# EAGLE design wf121_breakout_v10 (EAGLE 6.5.0)
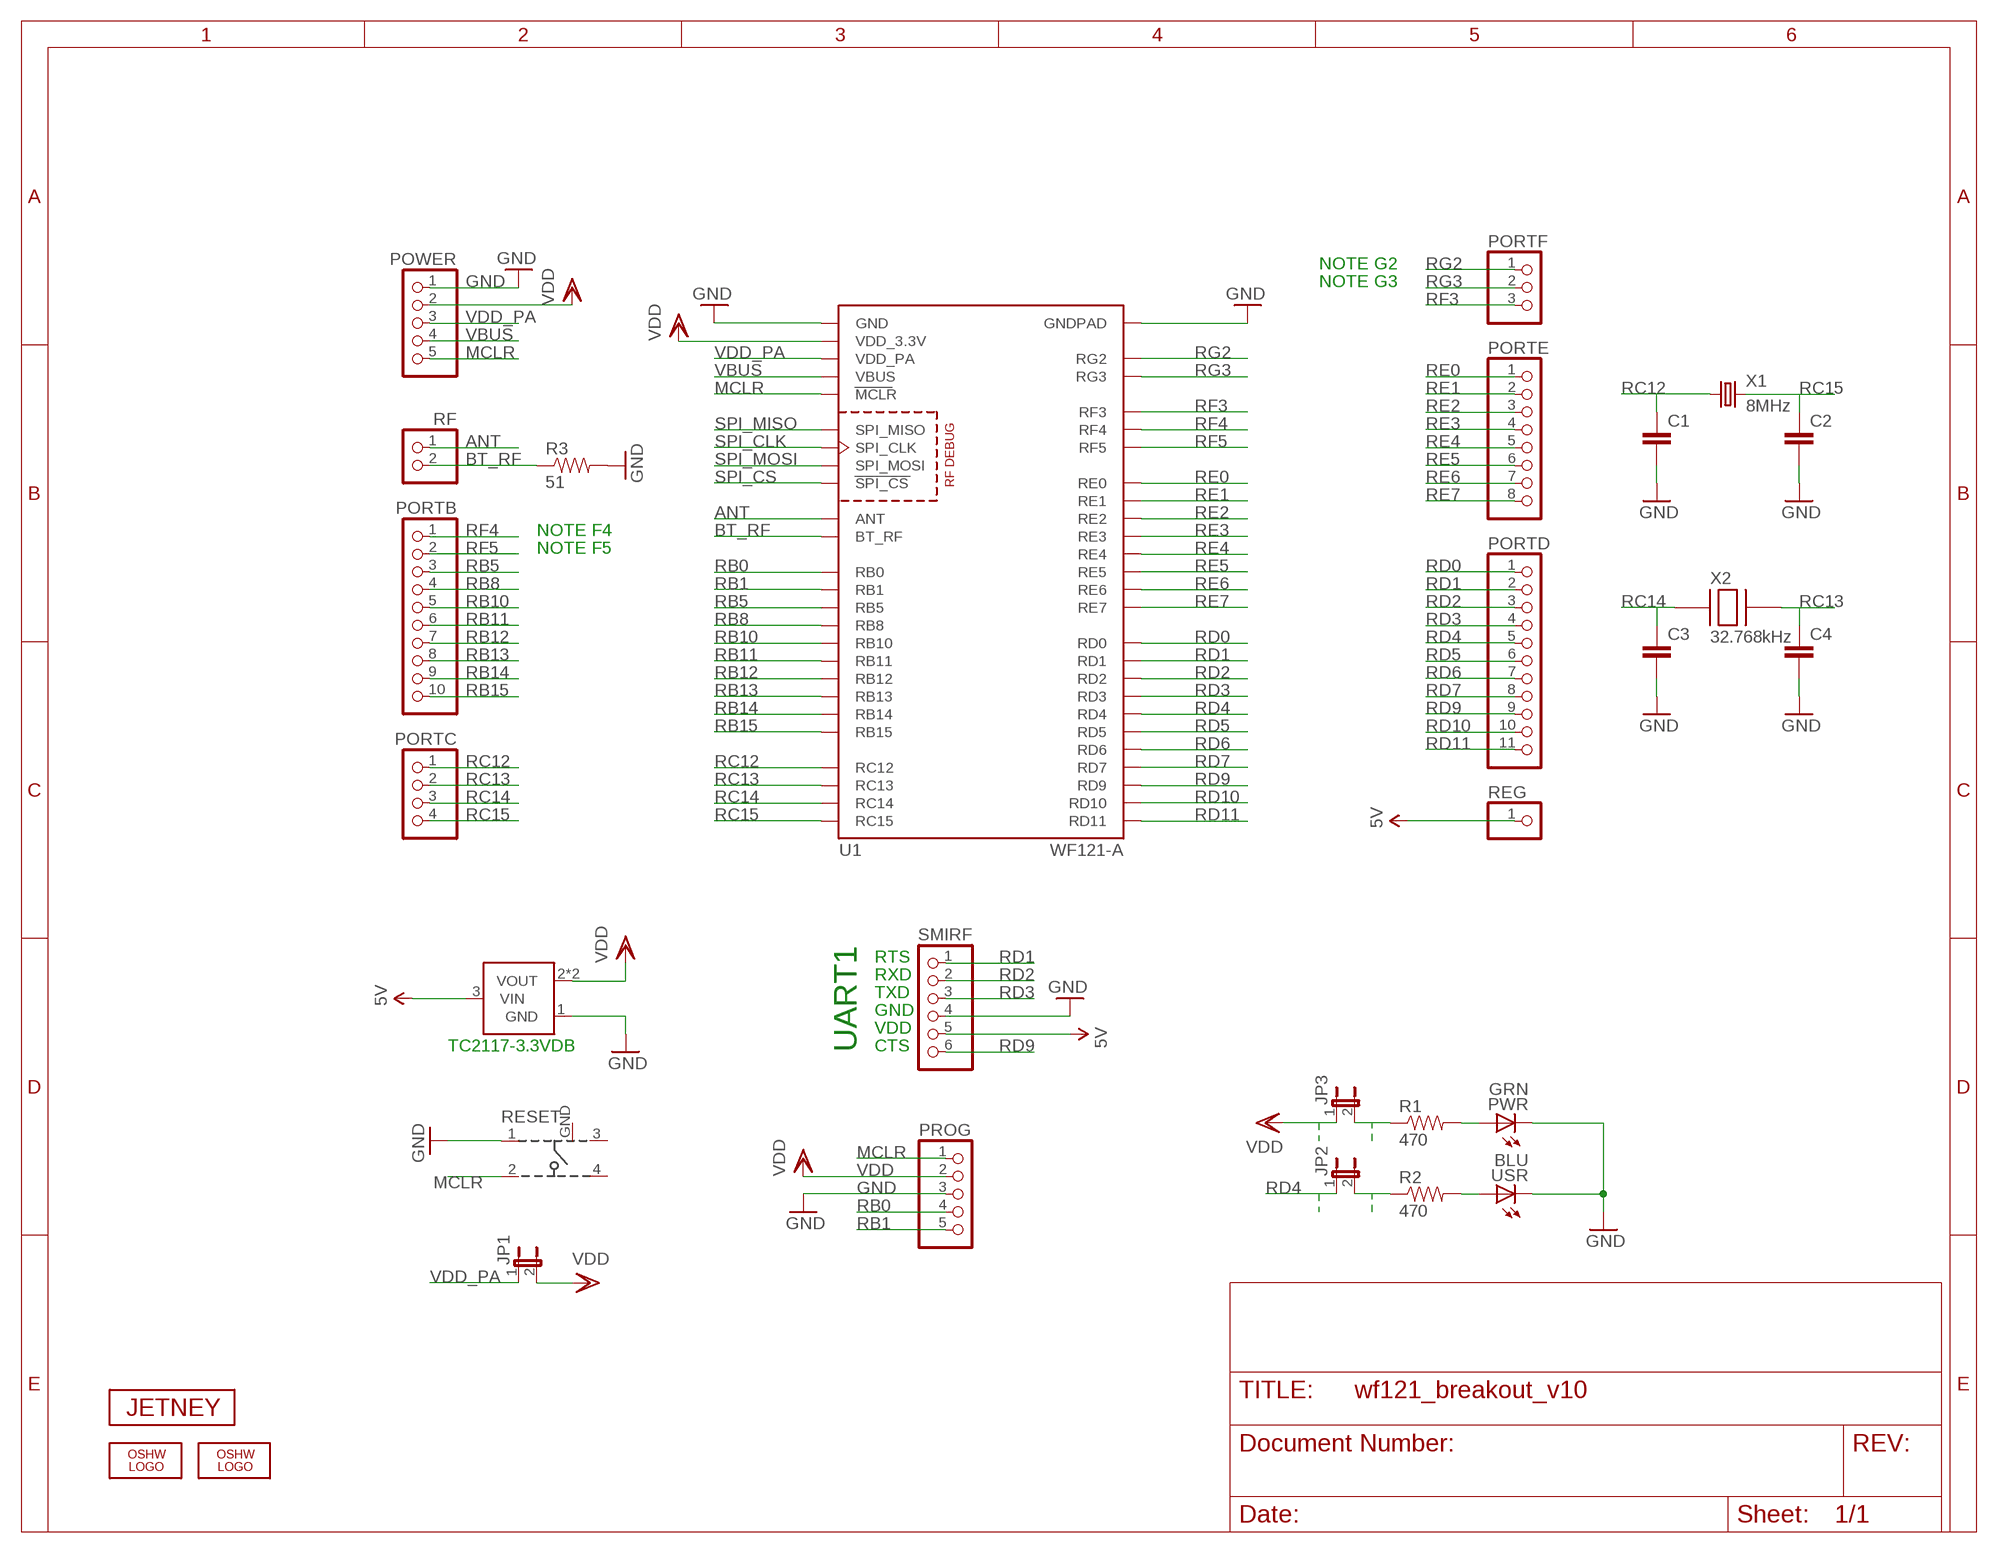
[diagram p0: schematic, sheet 1]

## Parts
C1  CAP0603-CAP  [0603-CAP]
C2  CAP0603-CAP  [0603-CAP]
C3  CAP0603-CAP  [0603-CAP]
C4  CAP0603-CAP  [0603-CAP]
JP1  JUMPER-2PTH  [1X02]
JP2  JUMPER-2SMD-NC  [SJ_2S]
JP3  JUMPER-2SMD-NC  [SJ_2S]
LOGO1  OSHW_LOGO_FILLX0100-NT  [OSHW_FILLX100_NOTEXT]
LOGO2  OSHW_LOGO_FILLX0100-NT  [OSHW_FILLX100_NOTEXT]
PORTB  PINHD-1X10  [1X10]
PORTC  PINHD-1X4  [1X04]
PORTD  PINHD-1X11  [1X11]
PORTE  PINHD-1X8  [1X08]
PORTF  PINHD-1X3  [1X03]
POWER  PINHD-1X5  [1X05]
PROG  PINHD-1X5  [1X05]
PWR  GRN  LEDCHIPLED_0805  [CHIPLED_0805]
R1  470  RESISTOR0603-RES  [0603-RES]
R2  470  RESISTOR0603-RES  [0603-RES]
R3  51  RESISTOR0603-RES  [0603-RES]
REG  PINHD-1X1  [1X01]
RESET  101-IG  [101-IG]
RF  PINHD-1X2  [1X02]
SMIRF  PINHD-1X6  [1X06]
U1  WF121-A  [WF121-A]
U2  VREGAP1117  [SOT223]
U$4  JETNEY-LOGO-12  [JETNEY-LOGO-12]
USR  BLU  LEDCHIPLED_0805  [CHIPLED_0805]
X1  8MHz  CRYSTALTXC-7A  [CRYSTAL-TXC-7A]
X2  32.768kHz  ABS07-120  [ABS07]

## Nets
5V [power]: REG.1 SMIRF.5 U2.3(VIN)
ANT: RF.1 U1.ANT
BT_RF: R3.1 RF.2 U1.BT_RF
GND [power]: C1.2 C2.2 C3.2 C4.2 POWER.1 PROG.3 PWR.C R3.2 RESET.1 SMIRF.4 U1.GND U1.GND@2(GND) U1.GND@3(GND) U1.GND@4(GND) U1.GND@5(GND) U1.GND@6(GND) U1.GNDPAD U2.1(GND) USR.C
MCLR: POWER.5 PROG.1 RESET.2 U1.MCLR
N$1: PWR.A R1.2
N$2: JP2.2 R2.1
N$3: R2.2 USR.A
N$4 [power]: JP3.2 R1.1
RB0: PROG.4 U1.RB0
RB1: PROG.5 U1.RB1
RB5: PORTB.3 U1.RB5
RB8: PORTB.4 U1.RB8
RB10: PORTB.5 U1.RB10
RB11: PORTB.6 U1.RB11
RB12: PORTB.7 U1.RB12
RB13: PORTB.8 U1.RB13
RB14: PORTB.9 U1.RB14
RB15: PORTB.10 U1.RB15
RC12: C1.1 PORTC.1 U1.RC12 X1.P$1
RC13: C4.1 PORTC.2 U1.RC13 X2.X2
RC14: C3.1 PORTC.3 U1.RC14 X2.X1
RC15: C2.1 PORTC.4 U1.RC15 X1.P$2
RD0: PORTD.1 U1.RD0
RD1: PORTD.2 SMIRF.1 U1.RD1
RD2: PORTD.3 SMIRF.2 U1.RD2
RD3: PORTD.4 SMIRF.3 U1.RD3
RD4: JP2.1 PORTD.5 U1.RD4
RD5: PORTD.6 U1.RD5
RD6: PORTD.7 U1.RD6
RD7: PORTD.8 U1.RD7
RD9: PORTD.9 SMIRF.6 U1.RD9
RD10: PORTD.10 U1.RD10
RD11: PORTD.11 U1.RD11
RE0: PORTE.1 U1.RE0
RE1: PORTE.2 U1.RE1
RE2: PORTE.3 U1.RE2
RE3: PORTE.4 U1.RE3
RE4: PORTE.5 U1.RE4
RE5: PORTE.6 U1.RE5
RE6: PORTE.7 U1.RE6
RE7: PORTE.8 U1.RE7
RF3: PORTF.3 U1.RF3
RF4: PORTB.1 U1.RF4
RF5: PORTB.2 U1.RF5
RG2: PORTF.1 U1.RG2
RG3: PORTF.2 U1.RG3
SPI_CLK: U1.SPI_CLK
SPI_CS: U1.SPI_CS
SPI_MISO: U1.SPI_MISO
SPI_MOSI: U1.SPI_MOSI
VBUS: POWER.4 U1.VBUS
VDD [power]: JP1.2 JP3.1 POWER.2 PROG.2 U1.VDD_3.3V U2.2(VOUT) U2.4(VOUT)
VDD_PA [power]: JP1.1 POWER.3 U1.VDD_PA
Unconnected: RESET.3 RESET.4

## Notes on the sheet
- NOTE G2
- NOTE G3
- NOTE F4
- NOTE F5
- RTS
- RXD
- TXD
- GND
- VDD
- TC2117-3.3VDB | UART1 | CTS

## Power pins joined to a net without a drawn wire
GND: RESET.GND

## Library data of the parts
C1-C4 = SparkFun-Passives:CAP: Capacitor Standard 0603 ceramic capacitor, and 0.1" leaded capacitor.
JP1-JP3 = SparkFun:JUMPER-2: Jumper Basic 0.1" spaced jumper. Use with breakaway headers.
LOGO1 LOGO2 = oshw-logo:OSHW_LOGO_FILL
PORTB = sf-pinhead:PINHD-1X10: PIN HEADER
PORTC = sf-pinhead:PINHD-1X4: PIN HEADER
PORTD = sf-pinhead:PINHD-1X11: PIN HEADER
PORTE = sf-pinhead:PINHD-1X8: PIN HEADER
PORTF = sf-pinhead:PINHD-1X3: PIN HEADER
POWER PROG = sf-pinhead:PINHD-1X5: PIN HEADER
PWR USR = adafruit:LED: LED OSRAM: - CHIPLED LG R971, LG N971, LY N971, LG Q971, LY Q971, LO R971, LY R971 LH N974, LH R974 LS Q976, LO Q976, LY Q976 LO Q996 - Hyper CHIPLED LW Q18S LB Q993, LB Q99A, LB R99A - SideLED LS A670, LO A670, LY A670, LG A670, LP A670 LB A673, LV A673, LT A673, LW A673 LH A674 LY A675 LS A676, LA A676, LO A676, LY A676, LW A676 LS A679, LY A679, LG A679 - Hyper Micro SIDELED® LS Y876, LA Y876, LO Y876, LY Y876 LT Y87S - SmartLED LW L88C, LW L88S LB L89C, LB L89S, LG L890 LS L89K, LO L89K, LY L89K LS L896, LA L896, LO L896, LY L896 - TOPLED LS T670, LO T670, LY T670, LG T670, LP T670 LSG T670, LSP T670, LSY T670, LOP T670, LYG T670 LG T671, LOG T671, LSG T671 LB T673, LV T673, LT T673, LW T673 LH T674 LS T676, LA T676, LO T676, LY T676, LB T676, LH T676, LSB T676, LW T676 LB T67C, LV T67C, LT T67C, LS T67K, LO T67K, LY T67K, LW E67C LS E67B, LA E67B, LO E67B, LY E67B, LB E67C, LV E67C, LT E67C LW T67C LS T679, LY T679, LG T679 LS T770, LO T770, LY T770, LG T770, LP T770 LB T773, LV T773, LT T773, LW T773 LH T774 LS E675, LA E675, LY E675, LS T675 LS T776, LA T776, LO T776, LY T776, LB T776 LHGB T686 LT T68C, LB T68C - Hyper Mini TOPLED® LB M676 - Mini TOPLED Santana® LG M470 LS M47K, LO M47K, LY M47K Source: http://www.osram.convergy.de/
R1-R3 = SparkFun:RESISTOR: Resistor Basic schematic elements and footprints for 0603, 1206, and PTH resistors.
REG = sf-pinhead:PINHD-1X1: PIN HEADER
RESET = sf-keyglove:101-IG
RF = sf-pinhead:PINHD-1X2: PIN HEADER
SMIRF = sf-pinhead:PINHD-1X6: PIN HEADER
U1 = sf-bluegiga:WF121: Bluegiga WF121 802.11b/g/n full-stack wi-fi module. WF121-A variant has an on-module ceramic chip antenna, WF121-E variant has a U.Fl connector. WF121-A variant includes keepout/restrict area. Antenna edge of the module should be flush up against the edge of the PCB. See datasheet for variant layout details. Bluegiga's WF121 is a stand-alone Wi-Fi module providing fully integrated 2.4GHz 802.11 b/g/n radio, TCP/IP stack and a 32-bit micro controller (MCU) platform for embedded applications requiring simple, low-cost and low-power wireless IP connectivity. It also provides flexible peripheral interfaces such as SPI, I2C, ADC, GPIO, Bluetooth co-existence, and timers to connect various peripheral interfaces directly to the WF121 Wi-Fi module. The WF121 Wi-Fi module also allows end-user applications to be embedded onto the on-board 32-bit MCU, using a simple Bluegiga BGScript™ scripting language and free-of-charge development tools. This eliminates need for and additional MCU and enables end users to develop smaller and lower cost Wi-Fi devices. The WF121 can also be used in modem-like mode in applications where the external MCU is needed. The 802.11 access point and HTTP server functionality is also included for easy configurations and direct connections with phones, tablets, and PCs. With an integrated 802.11 radio, antenna, single power supply, and CE, FCC, and IC regulatory certifications, the WF121 provides low-risk and fast time-to-market for applications requiring Wi-Fi connectivity. http://www.bluegiga.com/en-US/products/wifi-modules/wf121-wifi-module https://github.com/jrowberg/sf-oshw Last updated 2014-01-04 by Jeff Rowberg <jeff@rowberg.net>; ANTENNA: On-module ceramic chip antenna
U2 = nonolith:VREG
U$4 = sf-keyglove:JETNEY-LOGO
X1 = SparkFun-FreqCtrl:CRYSTAL: Various standard crystals. Proven footprints. Spark Fun Electronics SKU : COM-00534
X2 = sf-keyglove:ABS07-120

## Net classes
0 default: width 0.152 mm, drill 0.33 mm, clearance 0.152 mm
1 power: width 0.254 mm, drill 0.33 mm, clearance 0.152 mm

## Board
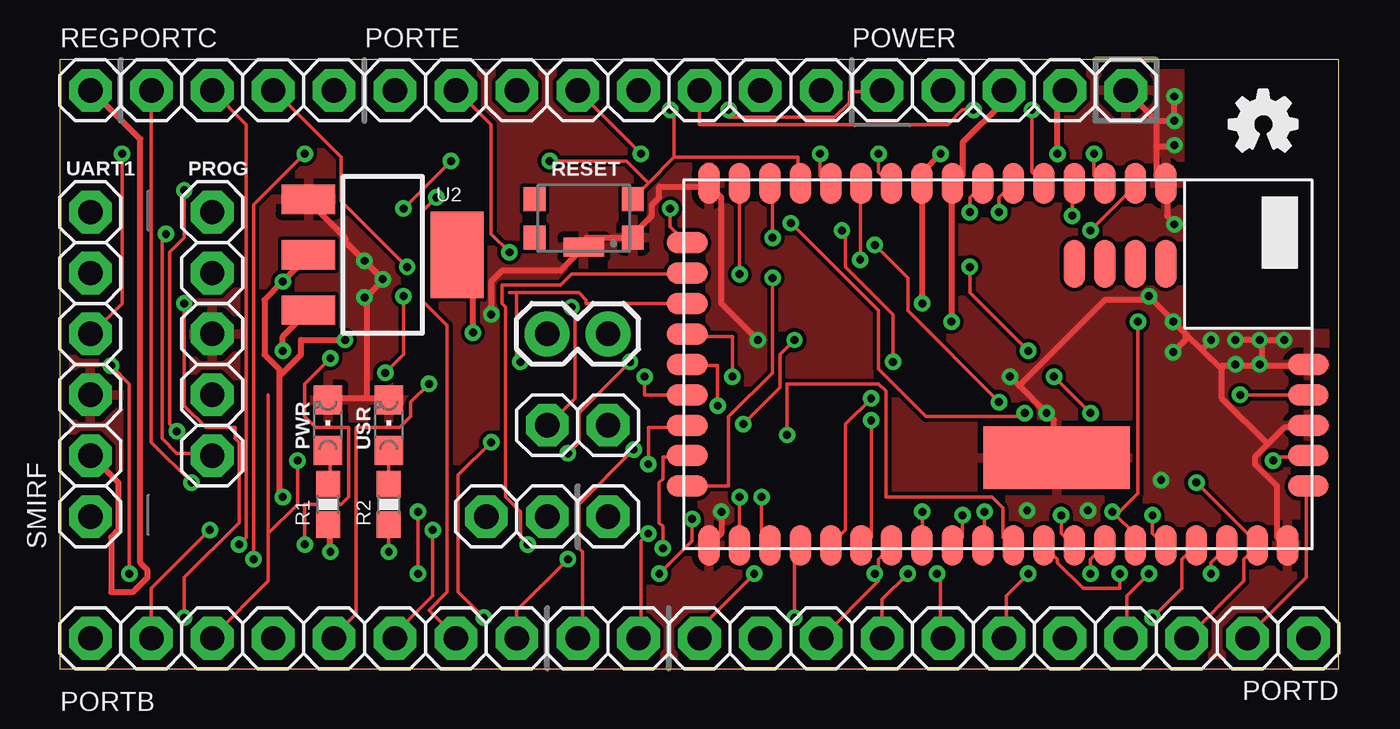
[diagram p1: board, top side]
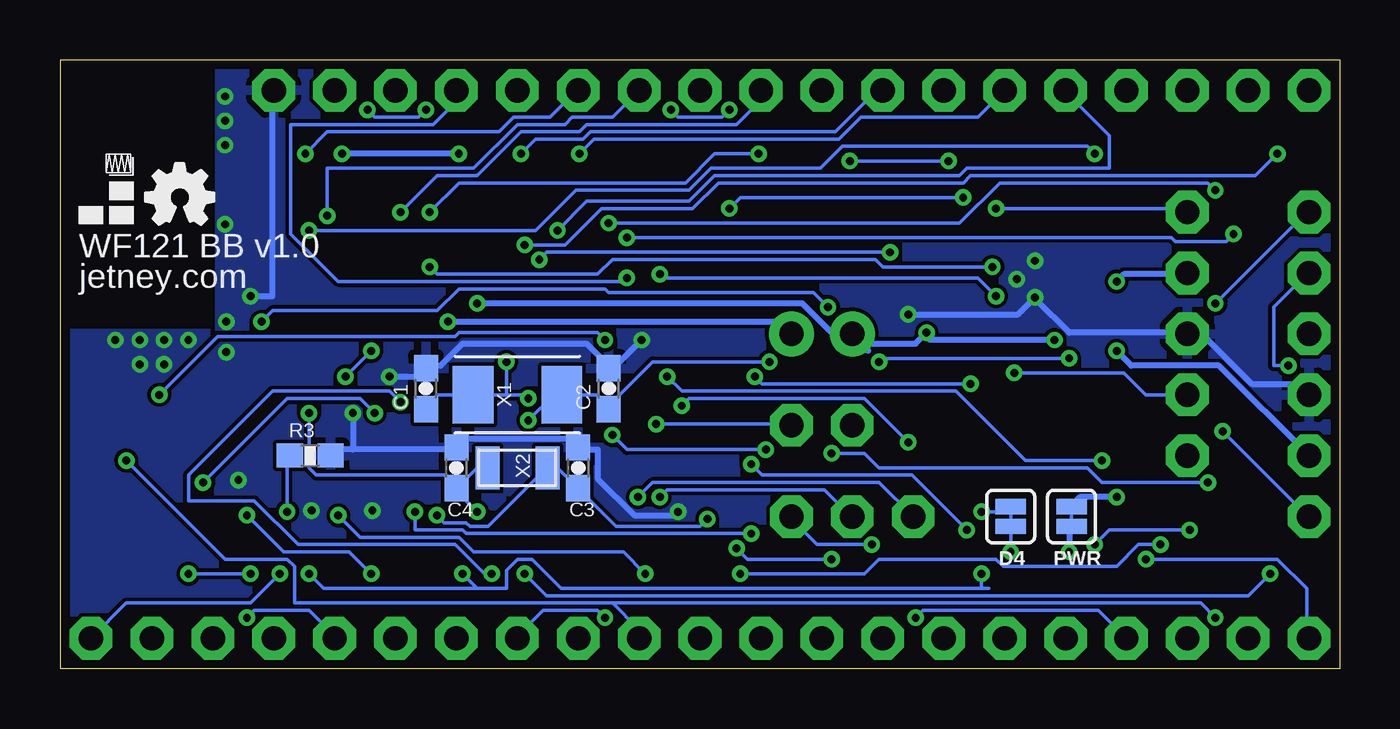
[diagram p2: board, bottom side, seen from below]

Size 53.34 x 25.4 mm. Coordinates in mm from the lower left corner, seen from the top.
Outline: 0,0 53.34,0 53.34,25.4 0,25.4 0,0
Copper layers (1*16): Top 0.0356mm / dielectric 1.5011mm / Bottom 0.0356mm
Design rules "LaenPCBOrder *": minimum track width 6mil, minimum drill 13mil, track to track 6mil, track to pad 6mil, pad to pad 6mil, via to via 6mil, smd to smd 6mil, copper to edge 15mil, drill to drill 6mil, minimum pad ring 7mil, minimum via ring 7mil, stop-mask expansion 4mil, vias tented up to drill 13mil, thermal gap 10mil
vRestrict: area 0,21.8 to 45.7,22.9; area 0,2.5 to 53.3,3.6; area 2.5,5.1 to 3.6,20.3; area 9.9,9.1 to 10.4,10.7; area 12.4,9.1 to 13,10.7; area 7.6,7.6 to 8.6,20.3; area 17,7.9 to 23.4,8.6; area 19.6,11.7 to 23.9,12.4; area 19.6,15.5 to 23.4,16.3

### Footprints (pad centres in the part's own frame; a part is rotated, then mirrored left to right if it is on the bottom)
0603-CAP = smd 1.1 x 1: 1 -0.85,0; 2 0.85,0
1X02 = drill 1.016 pad 1.88: 1 0,0; 2 2.54,0
SJ_2S = smd 0.635 x 1.27: 1 -0.412,0; 2 0.412,0
1X10 = drill 1.016 pad 1.778 octagon: 1 -11.43,0; 2 -8.89,0; 3 -6.35,0; 4 -3.81,0; 5 -1.27,0; 6 1.27,0; 7 3.81,0; 8 6.35,0; 9 8.89,0; 10 11.43,0
1X04 = drill 1.016 pad 1.778 octagon: 1 -3.81,0; 2 -1.27,0; 3 1.27,0; 4 3.81,0
1X11 = drill 1.016 pad 1.778 octagon: 1 -12.7,0; 2 -10.16,0; 3 -7.62,0; 4 -5.08,0; 5 -2.54,0; 6 0,0; 7 2.54,0; 8 5.08,0; 9 7.62,0; 10 10.16,0; 11 12.7,0
1X08 = drill 1.016 pad 1.778 octagon: 1 -8.89,0; 2 -6.35,0; 3 -3.81,0; 4 -1.27,0; 5 1.27,0; 6 3.81,0; 7 6.35,0; 8 8.89,0
1X03 = drill 1.016 pad 1.778 octagon: 1 -2.54,0; 2 0,0; 3 2.54,0
1X05 = drill 1.016 pad 1.778 octagon: 1 -5.08,0; 2 -2.54,0; 3 0,0; 4 2.54,0; 5 5.08,0
CHIPLED_0805 = smd 1.2 x 1.2: A 0,-1.05; C 0,1.05
0603-RES = smd 1.1 x 1: 1 -0.85,0; 2 0.85,0
1X01 = drill 1.016 pad 1.778 octagon: 1 0,0
101-IG = smd 0.9 x 1: 1 -2.05,0.8; 2 -2.05,-0.8; 3 2.05,0.8; 4 2.05,-0.8 | smd 1.7 x 0.8: GND 0,1.2
1X02' = drill 1.016 pad 1.778 octagon: 1 -1.27,0; 2 1.27,0
1X06 = drill 1.016 pad 1.778 octagon: 1 -6.35,0; 2 -3.81,0; 3 -1.27,0; 4 1.27,0; 5 3.81,0; 6 6.35,0
WF121-A = smd 0.9 x 1.7: ANT 1.27,12.95; GND@5 2.54,12.95; GND@6 0,12.95; RB5 3.81,-12.95; RB8 -5.08,-12.95; RB10 2.54,-12.95; RB11 1.27,-12.95; RB12 0,-12.95; RB13 -1.27,-12.95; RB14 -2.54,-12.95; RD1 3.81,12.95; RD10 5.08,12.95; RF3 -3.81,-12.95; VBUS 5.08,-12.95 | smd 1.7 x 0.9: BT_RF 7.55,5.73; GND -7.55,7; GND@2 -7.55,-12.05; GND@3 7.55,-12.05; GND@4 7.55,12.08; MCLR -7.55,-8.24; RB0 -7.55,-10.78; RB1 -7.55,-9.51; RB15 -7.55,5.73; RC12 7.55,-6.97; RC13 7.55,-3.16; RC14 7.55,-1.89; RC15 7.55,-5.7; RD0 7.55,3.19; RD2 7.55,-4.43; RD3 7.55,-8.24; RD4 7.55,4.46; RD5 7.55,7; RD6 7.55,8.27; RD7 7.55,9.54; RD9 7.55,10.81; RD11 7.55,1.92; RE0 -7.55,4.46; RE1 -7.55,3.19; RE2 -7.55,1.92; RE3 -7.55,0.65; RE4 -7.55,-0.62; RE5 -7.55,-4.43; RE6 -7.55,-5.7; RE7 -7.55,-6.97; RF4 7.55,-0.62; RF5 7.55,0.65; RG2 7.55,-9.51; RG3 7.55,-10.78; VDD_3.3V -7.55,-3.16; VDD_PA -7.55,-1.89 | smd 2.6 x 6.1: GNDPAD 3.9,2.45 | smd 2 x 0.9: SPI_CLK -4.2,5.73; SPI_CS -4.2,3.19; SPI_MISO -4.2,7; SPI_MOSI -4.2,4.46
SOT223 = smd 1.219 x 2.235: 1 -2.311,-3.099; 2 0,-3.099; 3 2.311,-3.099 | smd 3.6 x 2.2: 4 0,3.099
CRYSTAL-TXC-7A = smd 1.7 x 2.4: P$1 1.85,0; P$2 -1.85,0
ABS07 = smd 1 x 1.8: X1 -1.25,0; X2 1.25,0

### Placement (x,y rotation side)
C1  38.1,11.68 90 bottom
C2  30.48,11.68 90 bottom
C3  31.75,8.38 90 bottom
C4  36.83,8.38 90 bottom
JP1  22.86,13.97 180 top
JP2  13.72,6.35 270 bottom
JP3  11.18,6.35 270 bottom
LOGO1  48.77,21.59 0 top
LOGO2  49.78,18.54 0 bottom
PORTB  12.7,1.27 180 top
PORTC  7.62,24.13 180 top
PORTD  39.37,1.27 0 top
PORTE  22.86,24.13 180 top
PORTF  20.32,6.35 0 top
POWER  39.37,24.13 180 top
PROG  6.35,13.97 270 top
PWR  11.18,10.16 0 top
R1  11.18,6.86 90 top
R2  13.72,6.86 90 top
R3  42.93,8.89 0 bottom
REG  1.27,24.13 0 top
RESET  21.84,18.8 180 top
RF  [1X02']  21.59,10.16 180 top
SMIRF  1.27,12.7 270 top
U1  39.12,12.7 270 top
U2  13.46,17.27 270 top
U$4  52.58,18.54 0 bottom
USR  13.72,10.16 0 top
X1  34.29,11.43 180 bottom
X2  34.29,8.38 180 bottom

### Tracks (layer width: path | path; a pad name or v marks a point on that pad's centre or on a via)
5V  (via drill 0.33)
  Top 0.254: REG.1 1.37,24.08 3.35,22.1 3.35,4.42 3.66,4.12 3.66,3.81 3.05,3.2 2.13,3.2 2.13,5.49 2.44,5.79 2.44,7.77 1.37,8.84 SMIRF.5 | v9.3,13.26 9.3,13.87 10.36,14.94 U2.3
  Bottom 0.254: SMIRF.5 5.03,12.65 8.69,12.65 v9.3,13.26
ANT  (via drill 0.33)
  Top 0.152: v30.63,13.72 30.02,13.11 30.02,11.73 v28.5,10.21 | v49.23,11.43 U1.ANT
  Bottom 0.152: v49.23,11.43 46.79,13.87 36.88,13.87 36.73,14.02 30.94,14.02 v30.63,13.72 | v28.5,10.21 22.86,10.21 RF.1
BT_RF  (via drill 0.33)
  Top 0.152: 44.04,6.4 44.81,5.64 44.81,5.18 U1.BT_RF | 44.04,6.4 44.96,7.32 v44.96,14.48 | v21.34,15.09 21.49,14.94 21.49,11.28 20.42,10.21 RF.2 | 44.04,6.4 v43.89,6.55
  Bottom 0.152: v43.89,6.55 43.89,8.84 R3.1 | v44.96,14.48 44.5,14.94 37.64,14.94 36.73,15.85 30.63,15.85 30.48,15.7 21.95,15.7 v21.34,15.09
GND  (via drill 0.33)
  Top 0.254: 10.36,19.66 U2.1 10.36,19.51 11.89,17.98 11.89,17.83 v12.7,17.02 v13.46,16.26 13.41,16.15 12.8,15.54 v12.7,15.49 12.8,15.39 12.8,11.28 | v27.58,6.55 27.58,5.64 27.13,5.18 U1.GND@3 | 40.01,11.81 v41.15,10.67 41.45,10.36 41.45,8.84 U1.GNDPAD | 40.01,11.81 v39.62,12.19 | 45.72,22.86 45.72,21.79 | 45.72,21.79 45.72,20.57 46.02,20.27 U1.GND | POWER.1 45.72,22.86 | 50.37,9.37 51.05,10.06 51.97,10.06 U1.GND@5 52.12,10.21 | 50.37,9.37 49.84,8.84 49.84,8.53 50.75,7.62 50.75,5.49 51.05,5.18 U1.GND@4 51.21,5.18 | 49.07,12.65 48.46,12.65 48.46,12.5 | 49.07,12.65 50.14,12.65 | 50.14,12.65 51.97,12.65 U1.GND@6 52.12,12.8 | 48.46,12.5 48.46,11.28 50.37,9.37 | 48.46,12.5 47.62,13.32 | 47.62,13.32 47,13.93 | 47,13.93 v46.43,14.48 v45.41,15.54 45.41,15.39 43.59,15.39 40.01,11.81 | v29.11,13.72 27.58,15.24 27.58,19.66 27.13,20.12 U1.GND@2 | 12.8,11.28 13.72,11.28 USR.C | 12.8,11.28 11.28,11.28 PWR.C | v46.48,18.54 46.48,18.59 46.18,18.9 46.18,20.12 U1.GND | 46.18,20.27 U1.GND | 27.13,20.27 U1.GND@2 | v49.02,13.72 v50.04,13.72 50.14,13.72 | 50.14,13.72 v51.05,13.72 | 49.07,12.65 v49.02,12.7 | 50.14,12.65 v50.04,12.7 50.14,12.8 50.14,13.72 | v46.43,13.21 46.94,13.72 46.94,13.87 47,13.93 | v48.01,13.72 47.7,13.41 47.62,13.32 | 45.72,21.79 46.48,21.79 v46.48,21.84 | 45.72,22.86 v46.48,22.86 v46.48,23.88 | U1.GND@2 26.98,20.12 24.99,20.12 24.99,19.66 24.69,19.36 24.69,18.9 23.93,18.14 RESET.1 23.77,17.98 21.95,17.98 21.95,17.68 RESET.GND 21.79,17.53 20.88,16.61 18.44,16.61 17.98,16.15 v17.98,14.78
  Bottom 0.254: SMIRF.4 1.37,11.43 1.83,11.89 3.66,11.89 5.64,13.87 6.25,13.87 PROG.3 6.4,14.02 11.28,14.02 12.65,15.39 v12.7,15.49 13.41,14.78 v17.98,14.78 | 41.15,9.14 36.88,9.14 C4.2 36.73,9.3 36.42,9.6 32.16,9.6 31.85,9.3 C3.2 31.7,9.14 30.94,9.14 30.94,7.92 29.41,6.4 27.74,6.4 v27.58,6.55 | 41.15,9.14 41.91,9.14 42.06,8.99 R3.2 | v39.62,12.19 38.41,12.19 38.1,12.5 C1.2 38.1,12.65 37.49,12.65 36.58,13.56 31.39,13.56 30.48,12.65 C2.2 30.48,12.8 30.02,12.8 v29.11,13.72 | v41.15,10.67 41.15,9.14 | v45.41,15.54 44.5,15.54 44.5,24.08 POWER.1
  other vias: 42.88,6.6 45.92,7.87 40.34,6.6
  pour Bottom: 0,25.4 53.34,25.4 53.34,0 0,0
  pour Top: 0,25.4 53.34,25.4 53.34,0 0,0
MCLR  (via drill 0.33)
  Top 0.152: 25.6,21.34 24.54,20.27 | 24.54,20.27 23.93,19.66 RESET.2 | 25.6,21.34 30.79,21.34 30.79,20.27 U1.MCLR | v16.31,21.18 v14.33,19.2 | v20.42,21.18 23.62,21.18 24.54,20.27 | v27.89,23.32 27.89,23.01 32.31,23.01 32.92,23.62 32.92,24.08 34.29,24.08 POWER.5 | v25.45,23.32 25.6,23.16 25.6,21.34
  Bottom 0.152: v14.33,19.2 6.55,19.2 6.4,19.05 PROG.1 | v20.42,21.18 v16.31,21.18 | v27.89,23.32 27.58,23.01 25.76,23.01 v25.45,23.32
N$1
  Top 0.152: R1.2 11.28,7.77 11.28,8.99 PWR.A
N$2  (via drill 0.33)
  Top 0.152: v13.72,4.88 R2.1
  Bottom 0.152: JP2.2 v13.72,4.88
N$3
  Top 0.152: USR.A R2.2
N$4  (via drill 0.33)
  Top 0.254: v11.28,4.88 11.28,5.94 R1.1
  Bottom 0.254: v11.28,4.88 11.28,5.79 JP3.2
N$5
  Bottom 0.152: 11.18,6.6 11.18,6.1
N$6
  Bottom 0.152: 13.72,6.1 13.72,6.6
RB0  (via drill 0.33)
  Top 0.152: v28.35,16.46 28.35,20.12 U1.RB0 | v13.56,12.34 14.33,13.11 v14.33,15.54
  Bottom 0.152: v28.35,16.46 28.19,16.31 15.09,16.31 v14.33,15.54 | PROG.4 8.08,11.43 8.99,12.34 v13.56,12.34
RB1  (via drill 0.33)
  Top 0.152: v29.72,17.98 29.72,20.12 U1.RB1 | v4.42,18.14 4.27,17.98 4.27,9.6 4.88,8.99 6.25,8.99 PROG.5
  Bottom 0.152: v29.72,17.98 7.01,17.98 6.86,17.83 4.72,17.83 v4.42,18.14
RB5  (via drill 0.33)
  Top 0.152: v25.15,5.03 25.15,5.94 24.99,6.1 24.99,7.77 25.15,7.92 25.15,8.84 26.06,8.84 U1.RB5 | v21.18,4.57 19.05,2.44 PORTB.3
  Bottom 0.152: v25.15,5.03 24.69,4.57 v21.18,4.57
RB8  (via drill 0.33)
  Top 0.152: v25.45,19.2 25.45,18.44 26.06,17.83 U1.RB8 | v15.7,19.66 15.09,19.05 15.09,15.39 16.15,14.33 16.15,3.2 15.39,2.44 16.46,1.37 PORTB.4
  Bottom 0.152: v25.45,19.2 24.99,19.66 v15.7,19.66
RB10  (via drill 0.33)
  Top 0.152: v24.54,8.53 24.54,10.06 26.06,10.06 U1.RB10 | v15.54,5.79 15.54,3.05 14.02,1.52 14.02,1.37 PORTB.5
  Bottom 0.152: v24.54,8.53 24.08,8.08 17.83,8.08 v15.54,5.79
RB11  (via drill 0.33)
  Top 0.152: v24.38,12.19 24.38,11.43 U1.RB11 | v15.39,11.89 14.63,11.12 14.63,10.52 14.17,10.06 12.34,10.06 12.34,2.29 11.43,1.37 PORTB.6
  Bottom 0.152: v24.38,12.19 24.08,11.89 v15.39,11.89
RB12  (via drill 0.33)
  Top 0.152: v27.43,10.97 27.43,12.65 26.21,12.65 U1.RB12 | 8.99,1.37 PORTB.7 | v17.68,2.13 16.61,3.2 16.61,8.08 v17.98,9.45
  Bottom 0.152: v27.43,10.97 27.13,11.28 19.81,11.28 v17.98,9.45 | PORTB.7 10.06,2.44 17.37,2.44 v17.68,2.13
RB13  (via drill 0.33)
  Top 0.152: v28.04,12.19 28.04,13.87 26.21,13.87 U1.RB13 | 8.69,5.64 8.69,3.66 6.4,1.37 PORTB.8 | 8.69,5.64 8.69,11.43 | v9.91,8.69 9.91,6.86 8.69,5.64
  Bottom 0.152: v28.04,12.19 27.43,11.58 16,11.58 13.11,8.69 v9.91,8.69
RB14  (via drill 0.33)
  Top 0.152: 18.75,15.7 19.05,15.7 | 19.05,15.7 21.64,15.7 21.95,15.39 21.95,15.24 U1.RB14 | v6.25,5.79 3.81,3.35 PORTB.9 | 19.05,15.7 19.05,12.95 v19.2,12.8 | v11.28,12.95 10.21,11.89 10.21,10.52 10.67,10.06 12.04,10.06 12.04,7.16 11.73,6.86 10.21,6.86 v10.21,5.18
  Bottom 0.152: v19.2,12.8 19.05,12.95 v11.28,12.95 | v10.21,5.18 9.6,5.79 v6.25,5.79
RB15  (via drill 0.33)
  Top 0.152: v42.98,18.29 44.81,20.12 U1.RB15 | v10.21,21.49 8.08,19.36 v8.08,4.57
  Bottom 0.152: v42.98,18.29 33.53,18.29 31.85,19.96 27.13,19.96 26.21,20.88 21.64,20.88 20.73,21.79 10.52,21.79 v10.21,21.49 | v8.08,4.57 2.59,4.57 1.37,3.35 1.37,1.37 PORTB.10
RC12  (via drill 0.33)
  Top 0.152: v33.83,11.28 32.77,10.21 32.77,5.79 32.16,5.18 U1.RC12 | v32.61,18.29 32.77,18.14 32.77,16.76 34.75,14.78 v34.75,12.8
  Bottom 0.152: C1.1 38.1,10.97 37.64,11.43 X1.P$1 34.75,11.43 | v33.83,11.28 33.98,11.43 34.75,11.43 | v32.61,18.29 31.39,19.51 27.13,19.51 26.06,20.57 15.85,20.57 15.54,20.88 9.6,20.88 9.6,22.25 11.43,24.08 PORTC.1 | 34.75,11.43 v34.75,12.8
RC13  (via drill 0.33)
  Top 0.152: v35.97,6.55 35.97,5.18 U1.RC13 | v41.45,12.19 v42.98,10.67 | v40.39,13.26 37.95,15.7 v37.95,16.76 | v14.48,16.76 11.73,19.51 11.73,21.34 8.99,24.08 PORTC.2
  Bottom 0.152: X2.X2 35.97,8.38 36.73,7.62 C4.1 | v35.97,6.55 36.88,7.47 C4.1 | v42.98,10.67 42.98,8.38 42.67,8.08 37.34,8.08 36.88,7.62 C4.1 | v40.39,13.26 v41.45,12.19 | v37.95,16.76 37.64,16.46 30.94,16.46 30.33,17.07 19.36,17.07 19.05,16.76 v14.48,16.76
RC14  (via drill 0.33)
  Top 0.152: v37.64,6.4 37.64,5.49 37.34,5.18 U1.RC14 | PORTC.3 7.77,22.71 7.77,5.49 v7.47,5.18 | v24.99,3.96 26.36,5.33 v26.36,6.25
  Bottom 0.152: v37.64,6.4 37.34,6.1 36.42,6.1 36.27,5.94 35.51,5.94 33.07,8.38 X2.X1 32.61,8.38 31.85,7.62 C3.1 31.7,7.47 30.18,5.94 26.67,5.94 v26.36,6.25 | v24.99,3.96 19.81,3.96 19.2,4.57 14.33,4.57 14.02,4.27 9.3,4.27 8.38,5.18 v7.47,5.18
RC15  (via drill 0.33)
  Top 0.152: v33.83,10.36 33.83,5.49 33.53,5.18 U1.RC15 | PORTC.4 3.81,9.45 v5.49,7.77 | v21.18,8.99 21.64,9.45 21.64,10.67 v23.77,12.8
  Bottom 0.152: 30.48,10.97 30.94,11.43 X1.P$2 32.77,11.43 v33.83,10.36 | v5.49,7.77 9.91,7.77 10.52,8.38 19.2,8.38 19.81,8.99 v21.18,8.99 | v23.77,12.8 28.65,12.8 30.48,10.97 | 30.48,10.97 C2.1
RD0  (via drill 0.33)
  Top 0.152: v41.76,6.4 41.76,5.64 42.22,5.18 U1.RD0 | v28.96,3.96 26.67,1.68 PORTD.1
  Bottom 0.152: v41.76,6.4 40.84,5.49 36.73,5.49 36.12,4.88 29.87,4.88 v28.96,3.96
RD1  (via drill 0.33)
  Top 0.152: v50.6,8.69 50.6,8.84 51.97,8.84 U1.RD1 | v5.18,15.24 5.18,10.97 6.1,10.06 7.32,10.06 7.32,9.6 7.47,9.45 7.47,6.1 5.18,3.81 v5.18,2.13
  Bottom 0.152: v50.6,8.69 46.48,4.57 43.89,4.57 43.59,4.27 43.59,2.74 30.33,2.74 | 30.33,2.74 29.26,1.68 29.26,1.37 PORTD.2 | v5.18,15.24 1.37,19.05 SMIRF.1 | v5.18,2.13 5.79,2.74 30.33,2.74
RD2  (via drill 0.33)
  Top 0.152: 34.14,3.96 34.14,3.66 PORTD.3 | 34.14,3.96 34.14,4.57 34.59,5.03 U1.RD2 | v2.13,12.65 2.9,11.89 v2.9,3.96 | 34.14,3.96 v33.98,3.96
  Bottom 0.152: v2.13,12.65 2.74,12.65 2.74,15.09 1.37,16.46 SMIRF.2 | v2.9,3.96 3.81,3.05 33.07,3.05 v33.98,3.96
RD3  (via drill 0.33)
  Top 0.152: v30.63,2.13 30.63,4.88 30.79,5.03 U1.RD3 | v2.59,21.49 2.59,15.24 1.37,14.02 SMIRF.3 | v33.98,17.68 35.36,16.31 35.36,14.94 v39.17,11.12 | v35.36,3.96 34.29,2.9 PORTD.4
  Bottom 0.152: v30.63,2.13 30.94,2.44 33.22,2.44 34.29,1.37 PORTD.4 | v2.59,21.49 3.5,20.57 15.39,20.57 15.7,20.27 25.91,20.27 26.98,19.2 30.79,19.2 32.31,17.68 v33.98,17.68 | v39.17,11.12 39.62,11.58 44.5,11.58 48.01,8.08 48.01,7.01 45.26,7.01 43.43,5.18 36.88,5.18 35.66,3.96 v35.36,3.96
RD4  (via drill 0.33)
  Top 0.152: v36.58,3.96 36.73,3.81 36.73,1.37 PORTD.5 | v42.98,3.96 42.98,4.57 43.43,5.03 U1.RD4 | v14.94,3.96 v14.94,6.55
  Bottom 0.152: 14.94,3.35 32.46,3.35 33.68,4.57 34.29,4.57 34.75,4.12 34.75,3.35 35.97,3.35 | 14.94,3.35 14.63,3.35 | v36.58,3.96 35.97,3.35 | v42.98,3.96 42.37,3.35 35.97,3.35 | v14.94,6.55 13.87,6.55 13.72,6.71 JP2.1 | 14.94,3.35 v14.94,3.96
RD5  (via drill 0.33)
  Top 0.152: v45.57,6.4 45.57,5.64 46.02,5.18 U1.RD5 | v40.39,3.96 39.47,3.05 39.47,1.37 PORTD.6
  Bottom 0.152: v45.57,6.4 44.04,4.88 41.3,4.88 v40.39,3.96
RD6  (via drill 0.33)
  Top 0.152: v45.57,2.13 46.79,3.35 46.79,4.57 47.24,5.03 U1.RD6
  Bottom 0.152: v45.57,2.13 45.26,2.44 42.98,2.44 41.91,1.37 PORTD.7
RD7  (via drill 0.33)
  Top 0.152: v48.01,3.96 48.01,4.42 48.62,5.03 U1.RD7 | v45.41,3.96 44.5,3.05 44.5,1.37 PORTD.8
  Bottom 0.152: v45.41,3.96 v48.01,3.96
RD9  (via drill 0.33)
  Top 0.152: PORTD.9 49.38,3.66 49.38,4.57 49.84,5.03 U1.RD9 49.84,5.18 49.84,5.33 v47.4,7.77 | v4.88,9.91 4.57,10.21 4.57,17.37 5.18,17.98 v5.18,19.96 | v30.48,18.59 34.14,14.94 34.14,12.5 36.12,10.52 40.23,10.52 v40.23,10.67
  Bottom 0.152: v4.88,9.91 1.37,6.4 SMIRF.6 | v5.18,19.96 5.49,20.27 14.17,20.27 15.85,18.59 v30.48,18.59 | v40.23,10.67 40.84,11.28 43.89,11.28 v47.4,7.77
RD10
  Top 0.152: PORTD.10 49.53,1.37 51.97,3.81 51.97,7.62 U1.RD10
RD11  (via drill 0.33)
  Top 0.152: v44.2,3.96 44.2,3.35 42.67,3.35 41.6,4.42 41.6,4.57 41.15,5.03 U1.RD11
  Bottom 0.152: v44.2,3.96 45.41,2.74 50.6,2.74 PORTD.11
RE0  (via drill 0.33)
  Top 0.152: v43.13,21.49 43.13,20.57 43.43,20.27 U1.RE0
  Bottom 0.152: v43.13,21.49 42.22,22.4 35.05,22.4 34.44,23.01 32.92,23.01 31.85,24.08 PORTE.1
RE1  (via drill 0.33)
  Top 0.152: v42.22,18.9 42.22,20.12 U1.RE1
  Bottom 0.152: v42.22,18.9 42.22,20.88 36.12,20.88 34.29,22.71 32.31,22.71 32,23.01 30.33,23.01 PORTE.2
RE2  (via drill 0.33)
  Top 0.152: v40.54,23.32 40.54,20.73 41,20.27 U1.RE2 | v38.1,23.32 37.64,23.32 37.03,22.71 26.67,22.71 PORTE.3
  Bottom 0.152: v40.54,23.32 40.23,23.01 38.41,23.01 v38.1,23.32
RE3  (via drill 0.33)
  Top 0.152: v39.17,19.05 39.17,19.66 39.62,20.12 U1.RE3
  Bottom 0.152: v39.17,19.05 37.64,20.57 35.97,20.57 34.14,22.4 31.7,22.4 31.39,22.71 25.15,22.71 24.23,23.62 24.23,24.08 PORTE.4
RE4  (via drill 0.33)
  Top 0.152: v37.95,19.05 37.95,19.66 38.41,20.12 U1.RE4 | PORTE.5 v24.23,21.49
  Bottom 0.152: v37.95,19.05 36.73,20.27 27.28,20.27 26.06,21.49 v24.23,21.49
RE5  (via drill 0.33)
  Top 0.152: v34.14,21.49 34.14,20.73 34.59,20.27 U1.RE5
  Bottom 0.152: v34.14,21.49 33.53,22.1 31.55,22.1 31.24,22.4 21.03,22.4 19.36,24.08 19.05,24.08 PORTE.6
RE6  (via drill 0.33)
  Top 0.152: v33.38,17.07 33.38,20.12 U1.RE6 | v18.75,17.37 17.98,18.14 17.98,22.71 16.61,24.08 PORTE.7
  Bottom 0.152: v33.38,17.07 33.07,17.37 v18.75,17.37
RE7  (via drill 0.33)
  Top 0.152: v31.7,21.49 31.7,20.57 32,20.27 U1.RE7
  Bottom 0.152: v31.7,21.49 31.09,22.1 20.88,22.1 19.96,23.01 15.09,23.01 PORTE.8
RF3  (via drill 0.33)
  Top 0.152: U1.RF3 26.06,16.46 21.34,16.46 20.88,16 18.44,16 18.44,15.24 18.59,15.09 18.59,7.16 19.2,6.55 19.2,5.49 v19.51,5.18
  Bottom 0.152: v19.51,5.18 21.79,5.18 22.86,6.25 PORTF.3
RF4  (via drill 0.33)
  Top 0.152: v38.56,6.55 38.56,5.18 U1.RF4 | v24.54,5.64 24.23,5.33 24.23,1.37 PORTB.1
  Bottom 0.152: v38.56,6.55 38.56,5.79 36.58,5.79 36.42,5.64 v24.54,5.64
RF5  (via drill 0.33)
  Top 0.152: v30.33,9.75 30.33,11.89 34.14,11.89 34.44,11.58 34.44,7.16 38.86,7.16 39.32,6.71 39.32,5.49 39.62,5.18 U1.RF5 | v23.93,9.14 21.64,6.86 21.64,5.03 21.79,4.88 21.79,1.52 21.64,1.37 PORTB.2
  Bottom 0.152: v30.33,9.75 29.72,9.14 v23.93,9.14
RG2  (via drill 0.33)
  Top 0.152: v29.26,7.16 29.26,5.49 29.57,5.18 U1.RG2
  Bottom 0.152: v29.26,7.16 28.65,7.77 19.2,7.77 PORTF.1
RG3  (via drill 0.33)
  Top 0.152: v28.35,7.16 28.35,5.18 U1.RG3
  Bottom 0.152: v28.35,7.16 28.04,7.47 21.49,7.47 20.42,6.4 PORTF.2
VBUS  (via drill 0.33)
  Top 0.152: v29.72,16.31 29.72,12.34 27.89,10.52 27.89,7.62 U1.VBUS
  Bottom 0.152: v29.72,16.31 29.87,16.15 41.76,16.15 43.74,18.14 43.74,22.71 37.8,22.71 36.88,23.62 36.88,24.08 POWER.4
VDD  (via drill 0.33)
  Top 0.254: U2.2 10.36,17.22 v9.3,16.15 8.53,15.39 8.53,13.11 9.14,12.5 9.14,12.19 | v35.97,15.24 35.97,20.12 U1.VDD_3.3V 35.97,20.27 35.97,20.73 v36.73,21.49 | v41.6,21.49 41.6,23.77 41.91,24.08 POWER.2 | v17.22,14.02 17.22,16.61 16.61,17.22 U2.4 | v9.3,7.16 9.14,7.32 9.14,12.19 | v11.89,13.72 10.06,13.72 10.06,13.11 9.14,12.19
  Bottom 0.254: v9.3,16.15 8.99,16.46 6.4,16.46 PROG.2 | 19.66,13.26 20.27,13.87 JP1.2 | v35.97,15.24 22.4,15.24 21.18,14.02 20.42,14.02 JP1.2 | v36.73,21.49 v41.6,21.49 | JP1.2 19.81,13.56 17.68,13.56 v17.22,14.02 17.22,13.87 17.07,13.72 v11.89,13.72 | v9.3,7.16 10.82,7.16 11.12,6.86 JP3.1
VDD_PA  (via drill 0.33)
  Top 0.254: POWER.3 39.32,24.08 39.32,23.62 37.64,21.95 37.64,20.57 37.34,20.27 U1.VDD_PA 37.19,20.12 v37.19,14.48
  Bottom 0.254: v37.19,14.48 23.32,14.48 22.86,14.02 JP1.1

### Text on the board
tPlace: UART1 | PROG
bPlace: WF121 BB v1.0 | jetney.com | PWR | D4
tDocu: 5V | C15 C14 C13 C12 | E7 E6 E5 E4 E3 E2 E1 E0 | MCLR | VBUS | VPA 3V3 GND | RTS RXD TXD GND VCC CTS | MCLR | 3V3 GND RB0 RB1 | VDD-PA | BT | ANT | Bluegiga / WF121-A | G2 G3 F3 | B15 B14 B13 B12 B11 B10 | B8 B5 F5 F4 D0 D1 D2 D3 D4 D5 D6 D7 D9 | D10 D11
bDocu: 51 NO COEX